# Altium schematic sheet P15 Hi3531AV100(VO&I2S3.SchDoc
size 420 x 297 mm
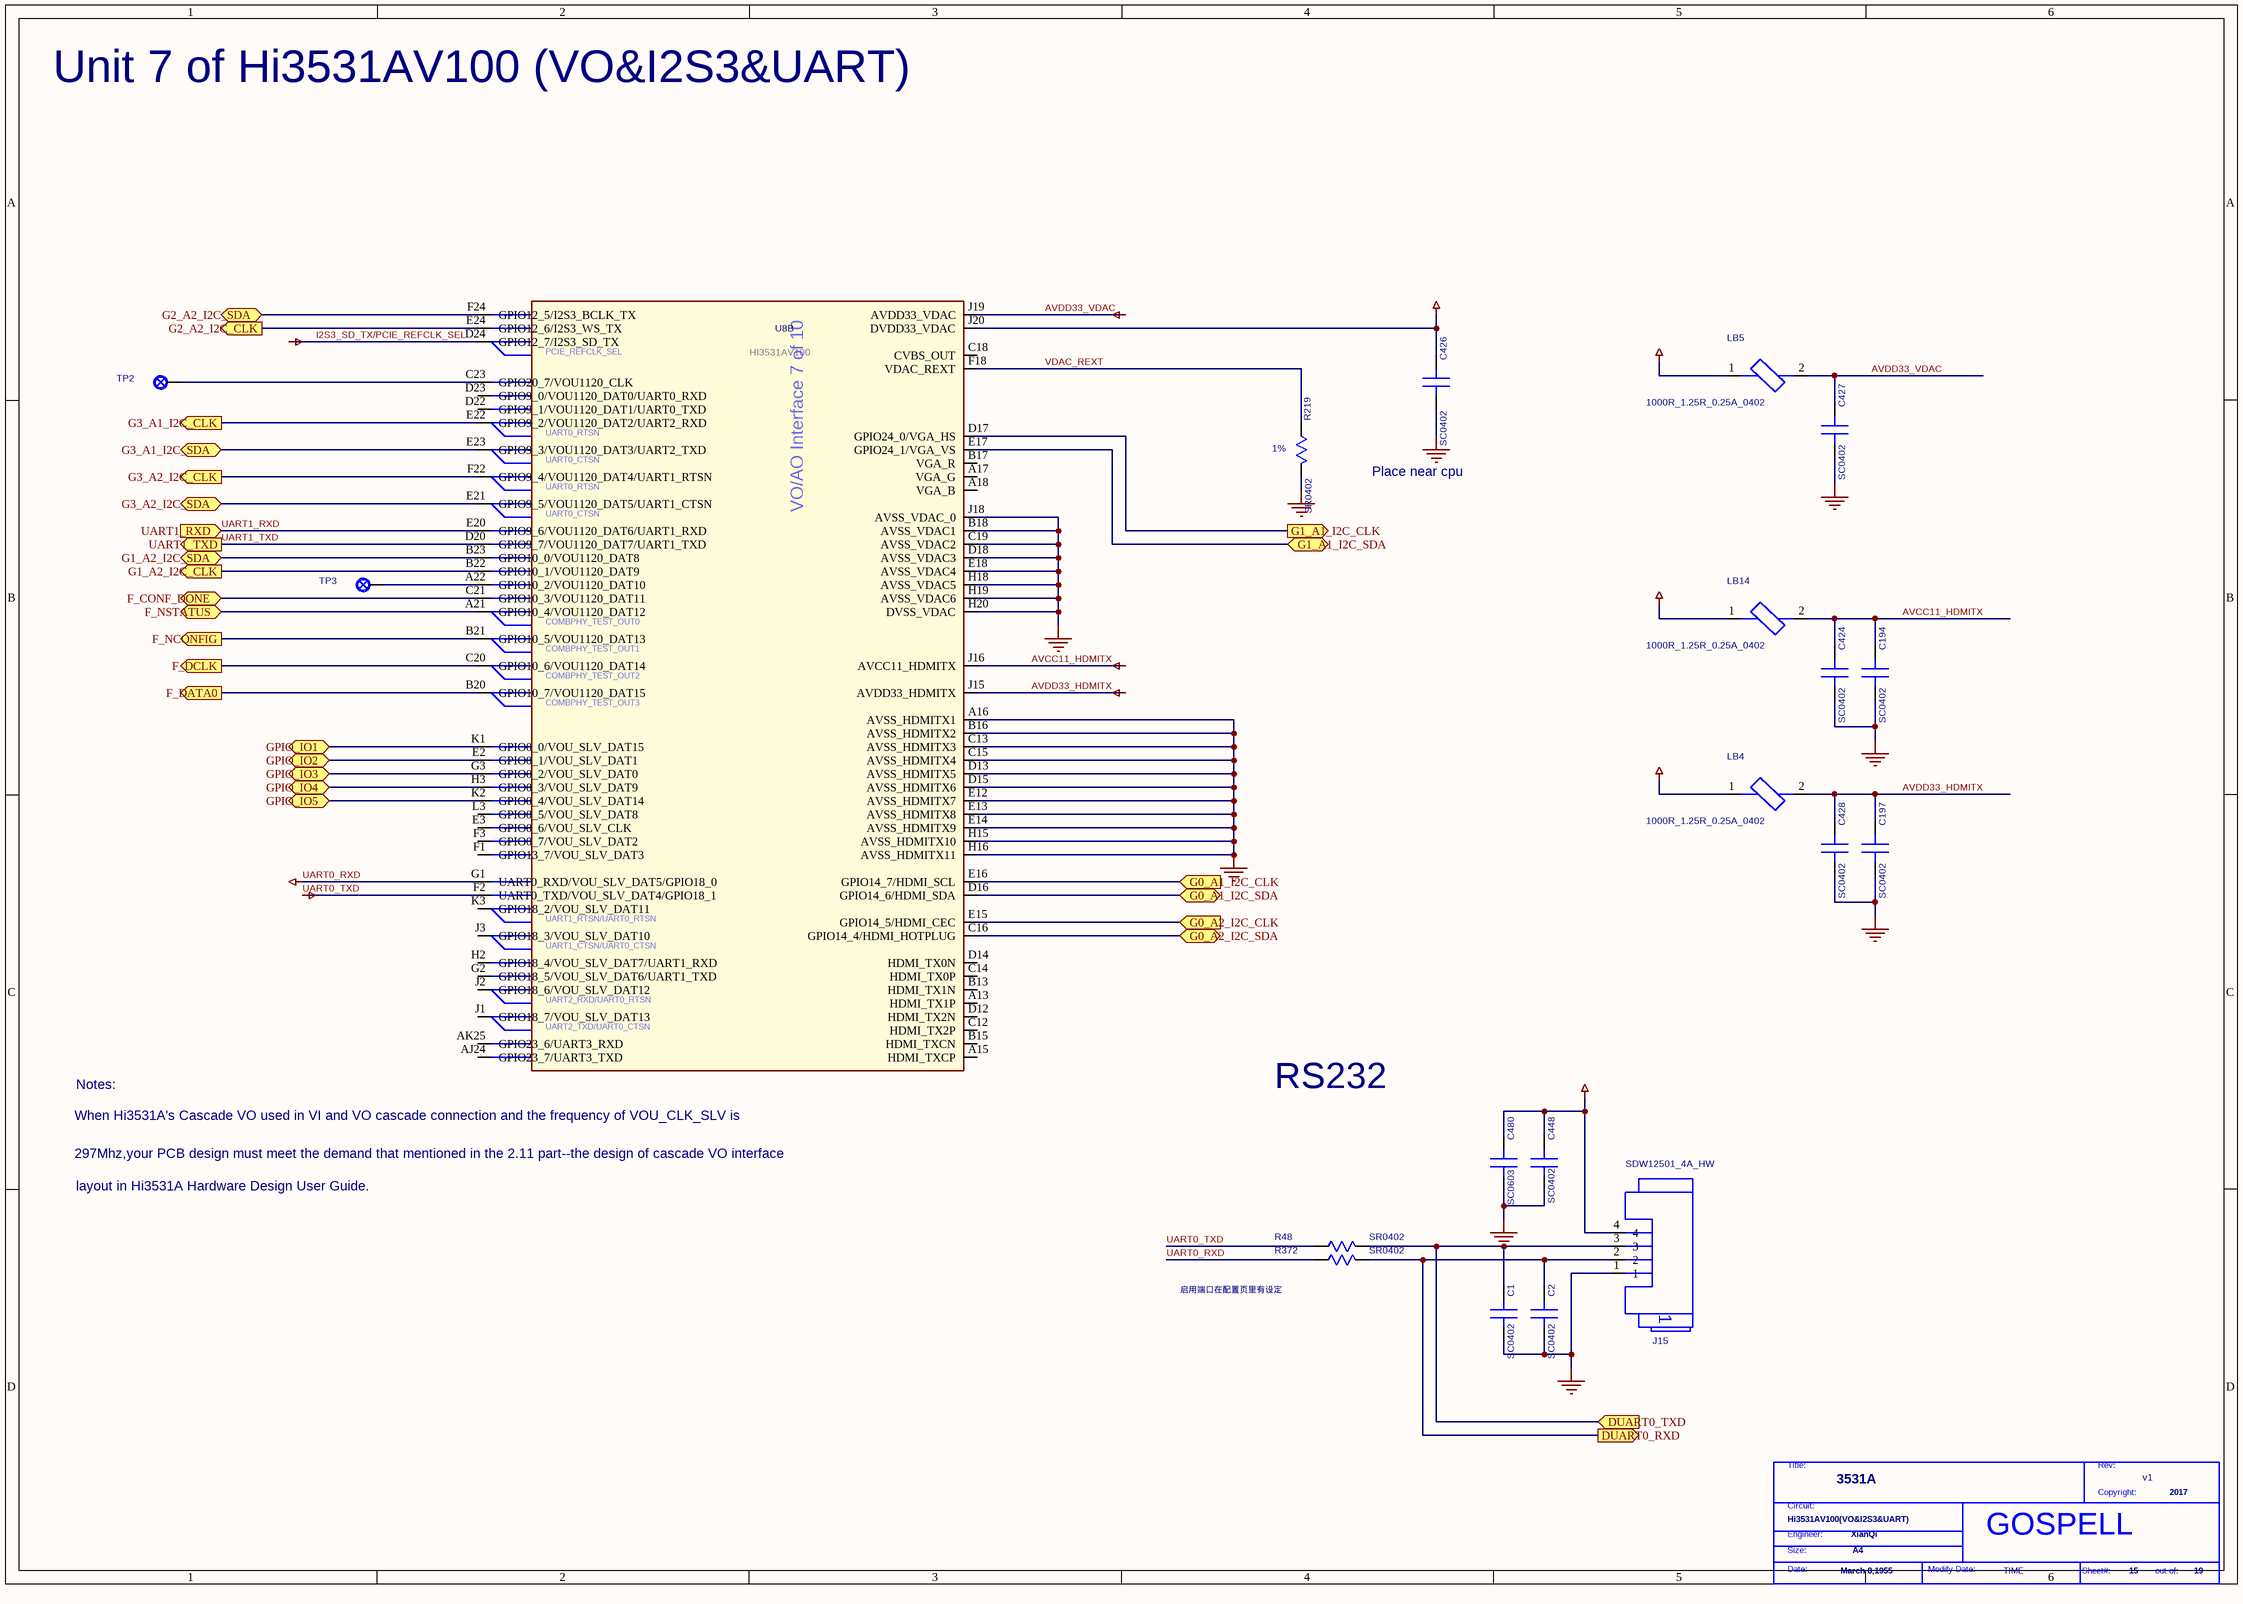
[diagram p0: P15 Hi3531AV100(VO&I2S3.SchDoc]

## Parts
*  Page Modify Date: TIME  Engineer: XianQi  Copyright: 2017  Title: 3531A  RevCode: v1  Page Size: A4  Page Create Date: March 8,1955  Page Number: 15  Page Count: 19  Doc: Hi3531AV100(VO&I2S3&UART)  (hidden comment: GOSPELL)  (graphical)
C1  SC0402  [SC0402]
C2  SC0402  [SC0402]
C194  SC0402  [SC0402]
C197  SC0402  [SC0402]
C424  SC0402  [SC0402]
C426  SC0402  [SC0402]
C427  SC0402  [SC0402]
C428  SC0402  [SC0402]
C448  SC0402  [SC0402]
C480  SC0603  [SC0603]
J15  DEVICE: SDW12501_4A_HW  [4PIN-2.54]  (hidden comment: 4PIN-2.54)
LB4  SL0402  [SL0402]  (value not drawn)
LB5  SL0402  [SL0402]  (value not drawn)
LB14  SL0402  [SL0402]  (value not drawn)
R48  SR0402  [SR0402]
R219  SR0402  [SR0402]
R372  SR0402  [SR0402]
TP2  TP24-SMD  [TP24-SMD]  (value not drawn)
TP3  TP24-SMD  [TP24-SMD]  (value not drawn)
U8  DEVICE: HI3531AV100  [BGA805-32-3333]  (hidden comment: BGA805-32-3333)  (part B of 10)

## Ports
DUART0_RXD (out), DUART0_TXD (in), F_CONF_DONE (bidir), F_DATA0 (out), F_DCLK (out), F_NCONFIG (out), F_NSTATUS (bidir), G0_A1_I2C_CLK (in), G0_A1_I2C_SDA (bidir), G0_A2_I2C_CLK (in), G0_A2_I2C_SDA (bidir), G1_A1_I2C_CLK (out), G1_A1_I2C_SDA (bidir), G1_A2_I2C_CLK (out), G1_A2_I2C_SDA (bidir), G2_A2_I2C_CLK (out), G2_A2_I2C_SDA (bidir), G3_A1_I2C_CLK (out), G3_A1_I2C_SDA (bidir), G3_A2_I2C_CLK (out), G3_A2_I2C_SDA (bidir), GPIO_IO1 (bidir), GPIO_IO2 (bidir), GPIO_IO3 (bidir), GPIO_IO4 (bidir), GPIO_IO5 (bidir), UART1_RXD (in), UART1_TXD (out)

## Nets
3V3: C426.1(A) C448.1(A) C480.1(A) J15.4 LB4.1 LB5.1 U8.J20(DVDD33_VDAC)
AVCC11_HDMITX: C194.1(A) C424.1(A) LB14.2 U8.J16(AVCC11_HDMITX)
AVDD33_HDMITX: C197.1(A) C428.1(A) LB4.2 U8.J15(AVDD33_HDMITX)
AVDD33_VDAC: C427.1(A) LB5.2 U8.J19(AVDD33_VDAC)
DVDD_CORE: LB14.1
GND: C1.2(B) C2.2(B) C194.2(B) C197.2(B) C424.2(B) C426.2(B) C427.2(B) C428.2(B) C448.2(B) C480.2(B) J15.1 R219.2(B) U8.A16(AVSS_HDMITX1) U8.B16(AVSS_HDMITX2) U8.B18(AVSS_VDAC1) U8.C13(AVSS_HDMITX3) U8.C15(AVSS_HDMITX4) U8.C19(AVSS_VDAC2) U8.D13(AVSS_HDMITX5) U8.D15(AVSS_HDMITX6) U8.D18(AVSS_VDAC3) U8.E12(AVSS_HDMITX7) U8.E13(AVSS_HDMITX8) U8.E14(AVSS_HDMITX9) U8.E18(AVSS_VDAC4) U8.H15(AVSS_HDMITX10) U8.H16(AVSS_HDMITX11) U8.H18(AVSS_VDAC5) U8.H19(AVSS_VDAC6) U8.H20(DVSS_VDAC) U8.J18(AVSS_VDAC_0)
I2S3_SD_TX/PCIE_REFCLK_SEL: U8.D24(GPIO12_7/I2S3_SD_TX)
UART0_RXD: R372.1(A) U8.G1(UART0_RXD/VOU_SLV_DAT5/GPIO18_0)
UART0_TXD: R48.1(A) U8.F2(UART0_TXD/VOU_SLV_DAT4/GPIO18_1)
DUART0_RXD: C2.1(A) J15.2 R372.2(B) ; port DUART0_RXD
DUART0_TXD: C1.1(A) J15.3 R48.2(B) ; port DUART0_TXD
F_CONF_DONE: U8.C21(GPIO10_3/VOU1120_DAT11) ; port F_CONF_DONE
F_DATA0: U8.B20(GPIO10_7/VOU1120_DAT15) ; port F_DATA0
F_DCLK: U8.C20(GPIO10_6/VOU1120_DAT14) ; port F_DCLK
F_NCONFIG: U8.B21(GPIO10_5/VOU1120_DAT13) ; port F_NCONFIG
F_NSTATUS: U8.A21(GPIO10_4/VOU1120_DAT12) ; port F_NSTATUS
G0_A1_I2C_CLK: U8.E16(GPIO14_7/HDMI_SCL) ; port G0_A1_I2C_CLK
G0_A1_I2C_SDA: U8.D16(GPIO14_6/HDMI_SDA) ; port G0_A1_I2C_SDA
G0_A2_I2C_CLK: U8.E15(GPIO14_5/HDMI_CEC) ; port G0_A2_I2C_CLK
G0_A2_I2C_SDA: U8.C16(GPIO14_4/HDMI_HOTPLUG) ; port G0_A2_I2C_SDA
G1_A1_I2C_CLK: U8.D17(GPIO24_0/VGA_HS) ; port G1_A1_I2C_CLK
G1_A1_I2C_SDA: U8.E17(GPIO24_1/VGA_VS) ; port G1_A1_I2C_SDA
G1_A2_I2C_CLK: U8.B22(GPIO10_1/VOU1120_DAT9) ; port G1_A2_I2C_CLK
G1_A2_I2C_SDA: U8.B23(GPIO10_0/VOU1120_DAT8) ; port G1_A2_I2C_SDA
G2_A2_I2C_CLK: U8.E24(GPIO12_6/I2S3_WS_TX) ; port G2_A2_I2C_CLK
G2_A2_I2C_SDA: U8.F24(GPIO12_5/I2S3_BCLK_TX) ; port G2_A2_I2C_SDA
G3_A1_I2C_CLK: U8.E22(GPIO9_2/VOU1120_DAT2/UART2_RXD) ; port G3_A1_I2C_CLK
G3_A1_I2C_SDA: U8.E23(GPIO9_3/VOU1120_DAT3/UART2_TXD) ; port G3_A1_I2C_SDA
G3_A2_I2C_CLK: U8.F22(GPIO9_4/VOU1120_DAT4/UART1_RTSN) ; port G3_A2_I2C_CLK
G3_A2_I2C_SDA: U8.E21(GPIO9_5/VOU1120_DAT5/UART1_CTSN) ; port G3_A2_I2C_SDA
GPIO_IO1: U8.K1(GPIO0_0/VOU_SLV_DAT15) ; port GPIO_IO1
GPIO_IO2: U8.E2(GPIO0_1/VOU_SLV_DAT1) ; port GPIO_IO2
GPIO_IO3: U8.G3(GPIO0_2/VOU_SLV_DAT0) ; port GPIO_IO3
GPIO_IO4: U8.H3(GPIO0_3/VOU_SLV_DAT9) ; port GPIO_IO4
GPIO_IO5: U8.K2(GPIO0_4/VOU_SLV_DAT14) ; port GPIO_IO5
UART1_RXD: U8.E20(GPIO9_6/VOU1120_DAT6/UART1_RXD) ; port UART1_RXD
UART1_TXD: U8.D20(GPIO9_7/VOU1120_DAT7/UART1_TXD) ; port UART1_TXD
VDAC_REXT: R219.1(A) U8.F18(VDAC_REXT)
NetTP2_1: TP2.1 U8.C23(GPIO20_7/VOU1120_CLK)
NetTP3_1: TP3.1 U8.A22(GPIO10_2/VOU1120_DAT10)

Not connected (* = marked no-connect by the designer): U8 A13(HDMI_TX1P) A15(HDMI_TXCP) A17(VGA_G) A18(VGA_B) AJ24(GPIO23_7/UART3_TXD) AK25(GPIO23_6/UART3_RXD) B13(HDMI_TX1N) B15(HDMI_TXCN) B17(VGA_R) C12(HDMI_TX2P) C14(HDMI_TX0P) C18(CVBS_OUT) D12(HDMI_TX2N) D14(HDMI_TX0N) D22(GPIO9_1/VOU1120_DAT1/UART0_TXD) D23(GPIO9_0/VOU1120_DAT0/UART0_RXD) E3(GPIO0_6/VOU_SLV_CLK) F1(GPIO13_7/VOU_SLV_DAT3) F3(GPIO0_7/VOU_SLV_DAT2) G2(GPIO18_5/VOU_SLV_DAT6/UART1_TXD) H2(GPIO18_4/VOU_SLV_DAT7/UART1_RXD) J1(GPIO18_7/VOU_SLV_DAT13) J2(GPIO18_6/VOU_SLV_DAT12) J3(GPIO18_3/VOU_SLV_DAT10) K3(GPIO18_2/VOU_SLV_DAT11) L3(GPIO0_5/VOU_SLV_DAT8)

## Notes on the sheet
- Unit 7 of Hi3531AV100 (VO&I2S3&UART)
- (near R219) 1%
- (near LB5) 1000R_1.25R_0.25A_0402
- Place near cpu
- (near LB14) 1000R_1.25R_0.25A_0402
- (near LB4) 1000R_1.25R_0.25A_0402
- (near U8) When Hi3531A's Cascade VO used in VI and VO cascade connection and the frequency of VOU_CLK_SLV is
- Notes:
- RS232
- 297Mhz,your PCB design must meet the demand that mentioned in the 2.11 part--the design of cascade VO interface
- layout in Hi3531A Hardware Design User Guide.
- 启用端口在配置页里有设定
- (in symbol GOSPELL) Title:; Rev:; Copyright:; Circuit:; Engineer:; Size:; Date:; Modify Date:; Sheet#:; out of:
- (in symbol HI3531AV100_M2_17, part B) PCIE_REFCLK_SEL; UART0_RTSN; UART0_CTSN; VO/AO Interface 7 of 10; COMBPHY_TEST_OUT0; COMBPHY_TEST_OUT1; COMBPHY_TEST_OUT2; COMBPHY_TEST_OUT3; UART1_RTSN/UART0_RTSN; UART1_CTSN/UART0_CTSN; UART2_RXD/UART0_RTSN; UART2_TXD/UART0_CTSN

## Library data of the parts
C1 = C_0_Dup1: PARTS: 1; OriginalSymbolOrigin: (0,30); DEVICE: 04025C102KAT2A; LEVEL: STD; PINSWAP: (A,B); %208%%161%%192%%224%%195%%251%%179%%198%: SMD陶瓷电容; COMPONENT_HIGH_MAX: 0.56MM; %182%%238%%182%%168%%185%%164%%215%%247%%181%%231%%209%%185%(V): 50; %195%%232%%202%%246%: SMD陶瓷电容-50V-1NF-+/-10%-X7R-0402-BT; CODE: 8070531; PKG_TYPE: SC0402
C2 = C_0_Dup1: PARTS: 1; OriginalSymbolOrigin: (0,30); DEVICE: 04025C102KAT2A; LEVEL: STD; PINSWAP: (A,B); CODE: 8070531; %195%%232%%202%%246%: SMD陶瓷电容-50V-1NF-+/-10%-X7R-0402-BT; %182%%238%%182%%168%%185%%164%%215%%247%%181%%231%%209%%185%(V): 50; COMPONENT_HIGH_MAX: 0.56MM; %208%%161%%192%%224%%195%%251%%179%%198%: SMD陶瓷电容; PKG_TYPE: SC0402
C194 = C_0_Dup2: PARTS: 1; PINSWAP: (A,B); LEVEL: STD; DEVICE: RMEMK105BJ104KV_FR; OriginalSymbolOrigin: (0,30); CODE: 8070614; %195%%232%%202%%246%: SMD陶瓷电容-16V-100NF-+/-10%-X7R-0402-BT; %182%%238%%182%%168%%185%%164%%215%%247%%181%%231%%209%%185%(V): 16; COMPONENT_HIGH_MAX: 0.6MM; %208%%161%%192%%224%%195%%251%%179%%198%: SMD陶瓷电容; PKG_TYPE: SC0402
C197 = C_0_Dup2: PARTS: 1; PINSWAP: (A,B); LEVEL: STD; DEVICE: RMEMK105BJ104KV_FR; OriginalSymbolOrigin: (0,30); %208%%161%%192%%224%%195%%251%%179%%198%: SMD陶瓷电容; COMPONENT_HIGH_MAX: 0.6MM; %182%%238%%182%%168%%185%%164%%215%%247%%181%%231%%209%%185%(V): 16; %195%%232%%202%%246%: SMD陶瓷电容-16V-100NF-+/-10%-X7R-0402-BT; CODE: 8070614; PKG_TYPE: SC0402
C424 C426-C428 = C_0_Dup2: PARTS: 1; PINSWAP: (A,B); LEVEL: STD; DEVICE: CV05X5R105K10AH; OriginalSymbolOrigin: (0,30); %208%%161%%192%%224%%195%%251%%179%%198%: SMD陶瓷电容; COMPONENT_HIGH_MAX: 0.55MM; %182%%238%%182%%168%%185%%164%%215%%247%%181%%231%%209%%185%(V): 10; %195%%232%%202%%246%: SMD陶瓷电容-10V-1000NF-+/-10%-X5R-0402-BT,TS16949; CODE: 8070612; PKG_TYPE: SC0402
C448 = C_0_Dup2: PARTS: 1; PINSWAP: (A,B); LEVEL: STD; DEVICE: RMEMK105BJ104KV_FR; OriginalSymbolOrigin: (0,30); %208%%161%%192%%224%%195%%251%%179%%198%: SMD陶瓷电容; COMPONENT_HIGH_MAX: 0.55MM; %182%%238%%182%%168%%185%%164%%215%%247%%181%%231%%209%%185%(V): 16; %195%%232%%202%%246%: SMD陶瓷电容-16V-100NF-+/-10%-X7R-0402-BT; CODE: 8070614; PKG_TYPE: SC0402
C480 = C_0_Dup2: PARTS: 1; PINSWAP: (A,B); LEVEL: STD; DEVICE: C1608X5R0J106MT0A0E; OriginalSymbolOrigin: (0,30); CODE: 8070649; %195%%232%%202%%246%: SMD陶瓷电容-6.3V-10000NF-+/-20%-X5R-0603-BT,TS16949; %182%%238%%182%%168%%185%%164%%215%%247%%181%%231%%209%%185%(V): 6.3; COMPONENT_HIGH_MAX: 0.9MM; %208%%161%%192%%224%%195%%251%%179%%198%: SMD陶瓷电容; PKG_TYPE: SC0603
J15 = WBC1X41_0: PARTS: 1; OriginalSymbolOrigin: (10,130); CODE: 14100167; PKG_TYPE: WBC0104-49T; LEVEL: STD; %208%%161%%192%%224%%195%%251%%179%%198%: 普通插座; COMPONENT_HIGH_MAX: 4.2MM; %195%%232%%202%%246%: 普通插座-4PIN-单排-直式-1.25MM-2MM-THT-1A
LB4 = LB_0: PARTS: 1; DEVICE: BLM15HG102SN1D; LEVEL: STD; OriginalSymbolOrigin: (20,50); CODE: 10070019; %195%%232%%202%%246%: EMI磁珠-+/-25%-1000OHM-1.25OHM-0.25A-0402-1400OHM@1GHZ-1400OHM@1GHZ; COMPONENT_HIGH_MAX: 0.55MM; %208%%161%%192%%224%%195%%251%%179%%198%: EMI磁珠; PKG_TYPE: SL0402
LB5 LB14 = LB_0: PARTS: 1; DEVICE: BLM15HG102SN1D; LEVEL: STD; OriginalSymbolOrigin: (20,50); %208%%161%%192%%224%%195%%251%%179%%198%: EMI磁珠; COMPONENT_HIGH_MAX: 0.55MM; %195%%232%%202%%246%: EMI磁珠-+/-25%-1000OHM-1.25OHM-0.25A-0402-1400OHM@1GHZ-1400OHM@1GHZ; CODE: 10070019; PKG_TYPE: SL0402
R48 R372 = R_1: PARTS: 1; LEVEL: STD; DEVICE: RC0402FR_0733RL; PINSWAP: (A,B); OriginalSymbolOrigin: (10,20); CODE: 7090836; %195%%232%%202%%246%: 片式厚膜电阻器-0.0625W-33OHM-+/-1%-0402; %182%%238%%182%%168%%185%%166%%194%%202%(W): 0.06; %215%%232%%214%%181%%212%%202%%208%%237%%198%%171%%178%%238%: +/-1%; COMPONENT_HIGH_MAX: 0.4MM; %208%%161%%192%%224%%195%%251%%179%%198%: 片式厚膜电阻器; PKG_TYPE: SR0402
R219 = R_1: PARTS: 1; LEVEL: STD; DEVICE: RC0402FR_0712K; PINSWAP: (A,B); OriginalSymbolOrigin: (10,20); %208%%161%%192%%224%%195%%251%%179%%198%: 片式厚膜电阻器; COMPONENT_HIGH_MAX: 0.4MM; %215%%232%%214%%181%%212%%202%%208%%237%%198%%171%%178%%238%: +/-1%; %182%%238%%182%%168%%185%%166%%194%%202%(W): 0.06; %195%%232%%202%%246%: 片式厚膜电阻器-0.0625W-12000OHM-+/-1%-0402; CODE: 7090817; PKG_TYPE: SR0402
TP2 TP3 = TESTPOINT_0: PARTS: 1; DEVICE: TEST-SMD; LEVEL: STD; OriginalSymbolOrigin: (20,20); PKG_TYPE: TP24-SMD
U8 = HI3531AV100_M2_17: FORWARD_PCB: 1; HETERO: (HI3531AV100_DDR1),(HI3531AV100_DDR2),(HI3531AV100_SYSTEM),(HI3531AV100_AD),(HI3531AV100_VO),(HI3531AV100_M1),(HI3531AV100_M2),(HI3531AV100_POWER),(HI3531AV100_VSS1),(HI3531AV100_VSS2); LEVEL: STD; OriginalSymbolOrigin: (30,630); CaptureCellPackProp: HI3531AV100_M2B; CODE: 35020607; PARTS: 1; PKG_TYPE: BGA805-32-3333